# Altium schematic sheet rf_detector_pwr.SchDoc: SPE Router
size 420 x 297 mm; Author: P. Daniel; CompanyName: WUT ISE; DrawnBy: P. Daniel; Organization: WUT ISE; Address1: WUT ISE; Address2: Nowowiejska 15/19 00-665 Warsaw; Address3: piotrmaciejdaniel@gmail.com; Revision: 1; SheetNumber: 2; SheetTotal: 6; ModifiedBy: -; CreateDate: 02-03.2023; CheckedDate: -; Title2: PoE power supply; DivGrp: WUT ISE; Designer: Piotr Daniel
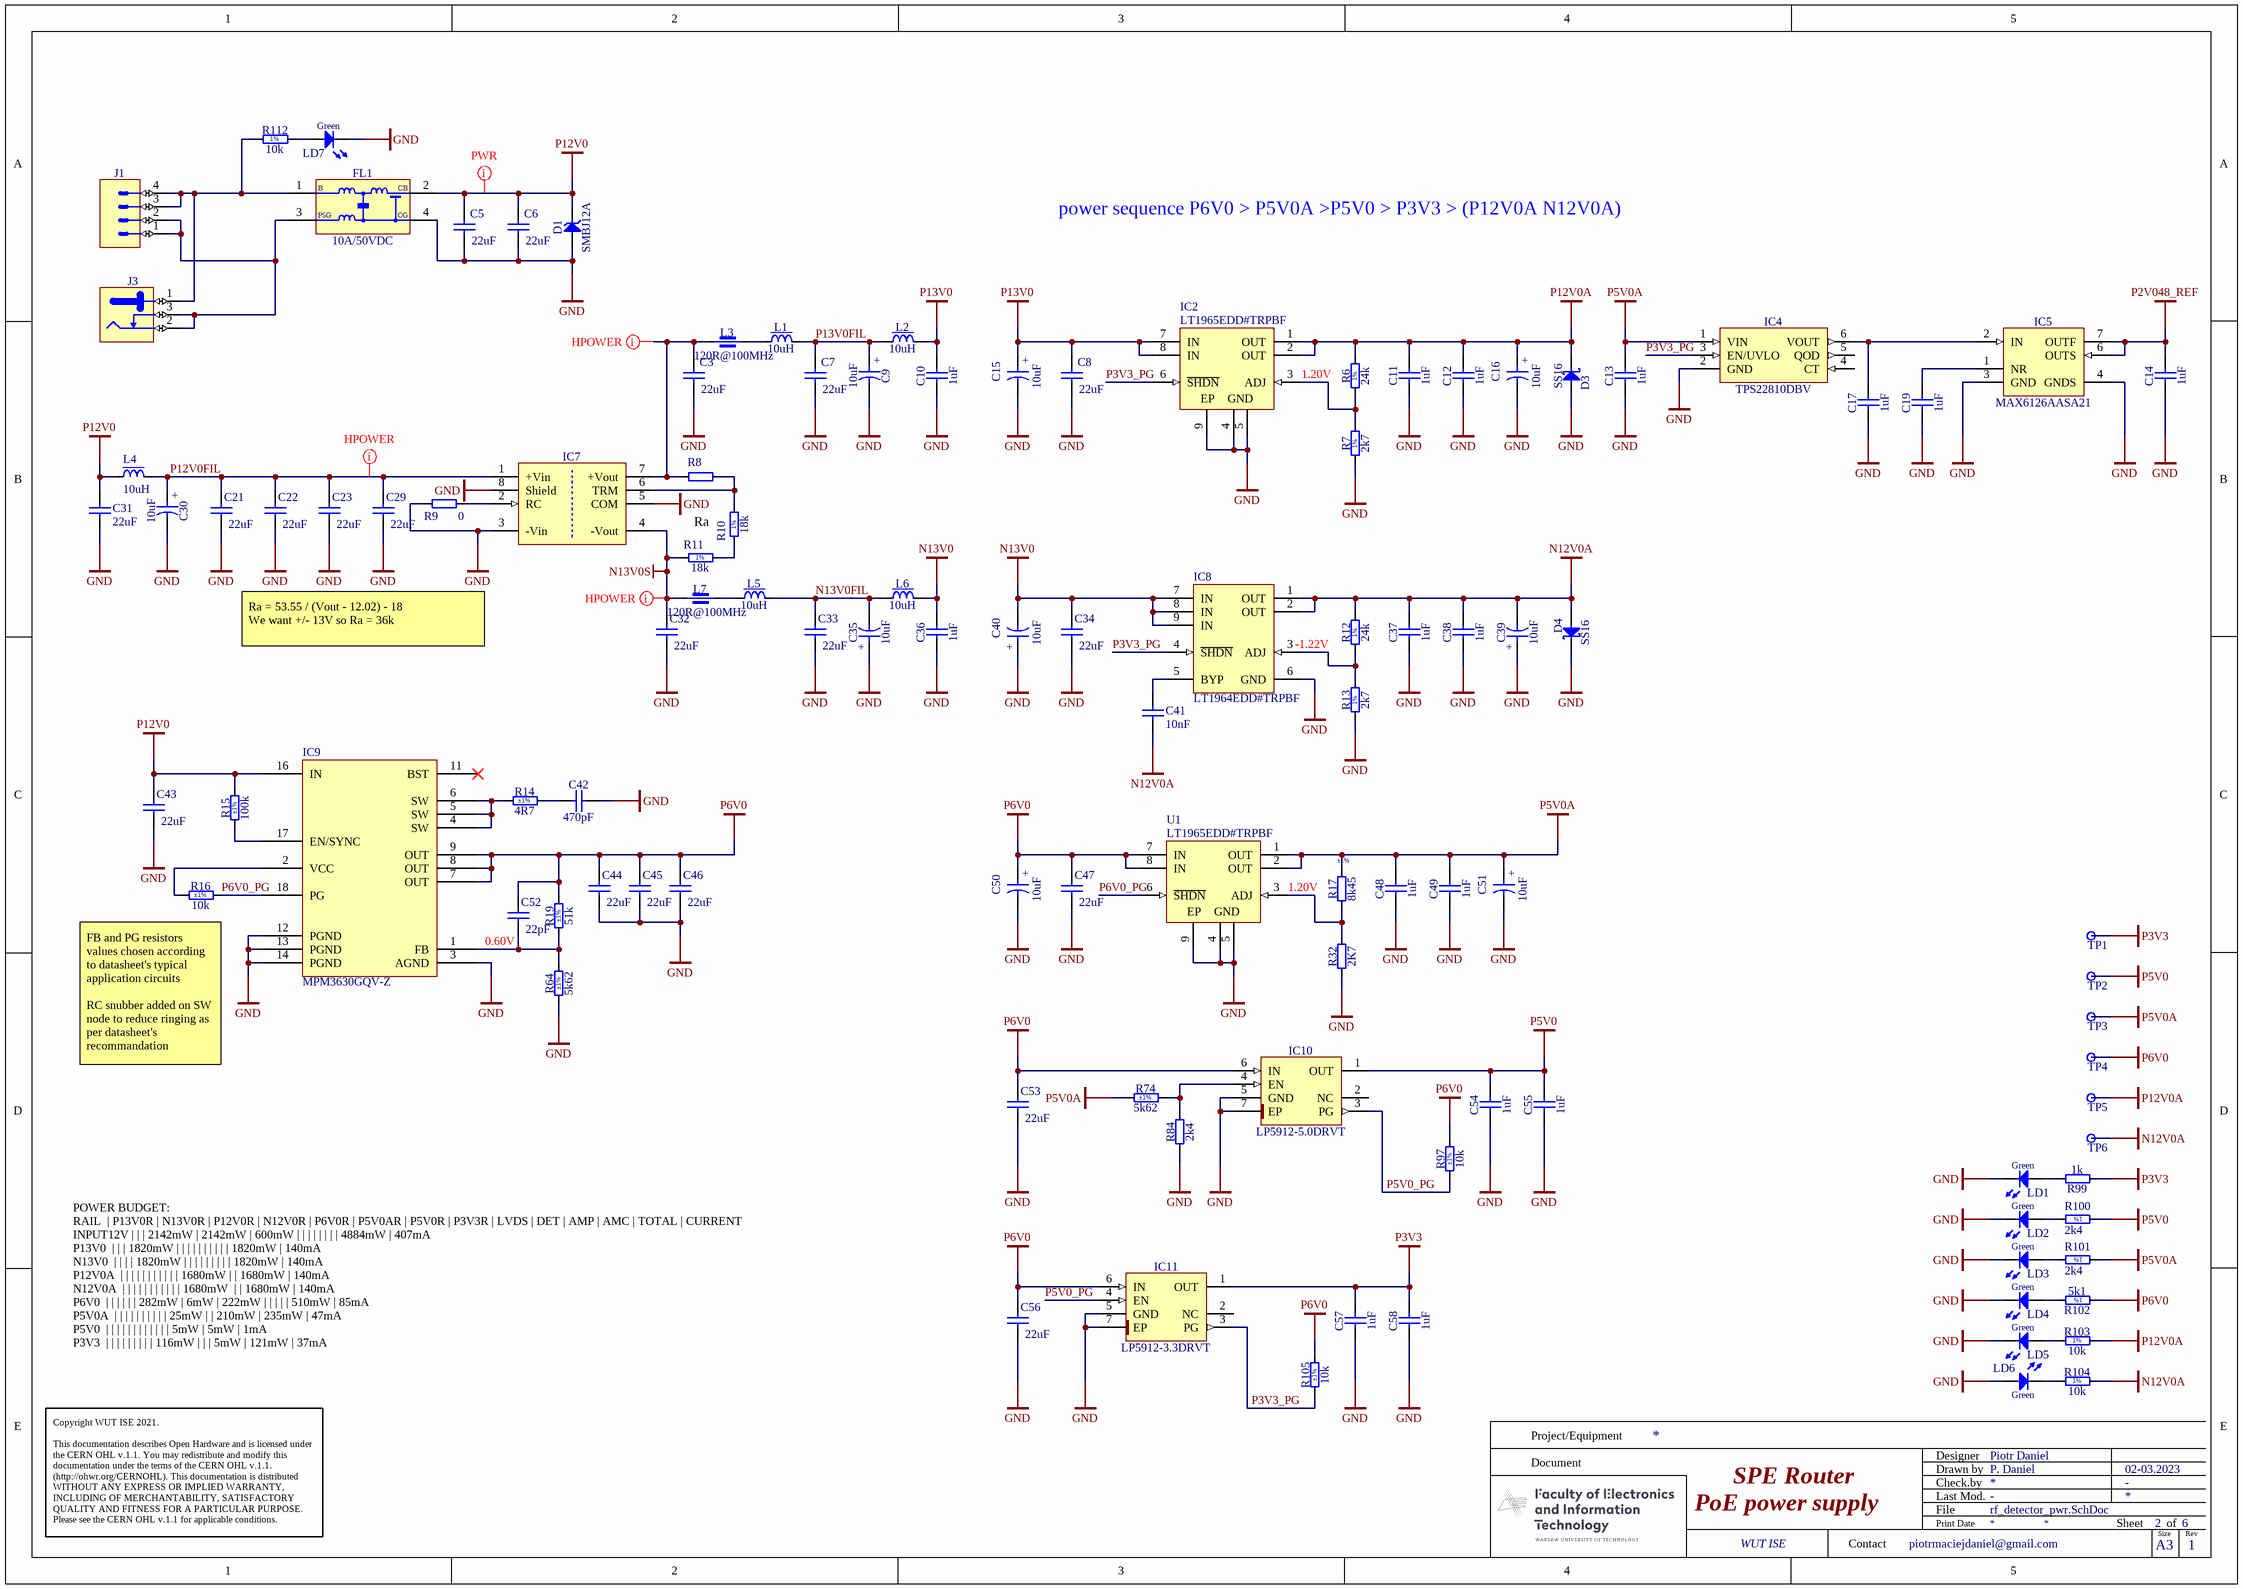
[diagram p0: rf_detector_pwr.SchDoc]

## Parts
C3  22uF  [CAPC3225X140N]
C5  22uF  [CAPC3225X140N]
C6  22uF  [CAPC3225X140N]
C7  22uF  [CAPC3225X140N]
C8  22uF  [CAPC3225X140N]
C9  10uF  [CAPMP3216X180N]
C10  1uF  [CAPC1608X87N]
C11  1uF  [CAPC1608X87N]
C12  1uF  [CAPC1608X87N]
C13  1uF  [CAPC1608X87N]
C14  1uF  [CAPC1608X87N]
C15  10uF  [CAPMP3216X180N]
C16  10uF  [CAPMP3216X180N]
C17  1uF  [CAPC1608X87N]
C19  1uF  [CAPC1608X87N]
C21  22uF  [CAPC3225X140N]
C22  22uF  [CAPC3225X140N]
C23  22uF  [CAPC3225X140N]
C29  22uF  [CAPC3225X140N]
C30  10uF  [CAPMP3216X180N]
C31  22uF  [CAPC2012X135N]
C32  22uF  [CAPC3225X140N]
C33  22uF  [CAPC3225X140N]
C34  22uF  [CAPC3225X140N]
C35  10uF  [CAPMP3216X180N]
C36  1uF  [CAPC1608X87N]
C37  1uF  [CAPC1608X87N]
C38  1uF  [CAPC1608X87N]
C39  10uF  [CAPMP3216X180N]
C40  10uF  [CAPMP3216X180N]
C41  10nF  [CAPC1608X87N]
C42  470pF  [CAPC1005X55N]
C43  22uF  [CAPC3225X140N]
C44  22uF  [CAPC3225X140N]
C45  22uF  [CAPC3225X140N]
C46  22uF  [CAPC3225X140N]
C47  22uF  [CAPC3225X140N]
C48  1uF  [CAPC1608X87N]
C49  1uF  [CAPC1608X87N]
C50  10uF  [CAPMP3216X180N]
C51  10uF  [CAPMP3216X180N]
C52  22pF  [CAPC1005X55N]
C53  22uF  [CAPC3225X140N]
C54  1uF  [CAPC1608X87N]
C55  1uF  [CAPC1608X87N]
C56  22uF  [CAPC3225X140N]
C57  1uF  [CAPC1608X87N]
C58  1uF  [CAPC1608X87N]
D1  SMBJ12A  [DIOM5336X265N]
D3  SS16  [DIOM5127X229N]
D4  SS16  [DIOM5127X229N]
FL1  10A/50VDC  [FIL_MURATA_BNX02]
IC2  LT1965EDD#TRPBF  [LT-DD-8_V]
IC4  TPS22810DBV  [SOT95P280X145-6N]
IC5  MAX6126AASA21  [SOIC127P600X175-8N]
IC7  (no value)  [CC6-1212DF-E]
IC8  LT1964EDD#TRPBF  [LT-DD-8_V]
IC9  MPM3630GQV-Z  [MPM3610A]
IC10  LP5912-5.0DRVT  [SON65P200X200X80-7N-R110X170]
IC11  LP5912-3.3DRVT  [SON65P200X200X80-7N-R110X170]
J1  Mini-Fit Jr.™  [MOLEX_39-30-0040]  (value not drawn)
J3  Jack  [SWITCHCRAFT_712RA]  (value not drawn)
L1  10uH  [IND_MURATA-PS_8400]
L2  10uH  [IND_MURATA-PS_8400]
L3  120R@100MHz  [INDC1608X95N]
L4  10uH  [IND_MURATA-PS_8400]
L5  10uH  [IND_MURATA-PS_8400]
L6  10uH  [IND_MURATA-PS_8400]
L7  120R@100MHz  [INDC1608X95N]
LD1  Green  [LED_KINGBRIGHT_KPH-1608CGCK]
LD2  Green  [LED_KINGBRIGHT_KPH-1608CGCK]
LD3  Green  [LED_KINGBRIGHT_KPH-1608CGCK]
LD4  Green  [LED_KINGBRIGHT_KPH-1608CGCK]
LD5  Green  [LED_KINGBRIGHT_KPH-1608CGCK]
LD6  Green  [LED_KINGBRIGHT_KPH-1608CGCK]
LD7  Green  [LED_KINGBRIGHT_KPH-1608CGCK]
R6  24k  [RESC1608X55N]
R7  2k7  [RESC1608X55N]
R8  Undefined  [RESC1608X55N]  (value not drawn)
R9  0  [RESC1005X40N]
R10  18k  [RESC1005X40N]
R11  18k  [RESC1005X40N]
R12  24k  [RESC1608X55N]
R13  2k7  [RESC1608X55N]
R14  4R7  Tolerance: ±1%  [RESC1005X40N]
R15  100k  Tolerance: ±1%  [RESC1005X40N]
R16  10k  Tolerance: ±1%  [RESC1005X40N]
R17  8k45  Tolerance: ±1%  [RESC1005X40N]
R19  51k  Tolerance: ±1%  [RESC1005X40N]
R32  2K7  [RESC1005X40N]
R64  5k62  Tolerance: ±1%  [RESC1005X40N]
R74  5k62  Tolerance: ±1%  [RESC1005X40N]
R84  2k4  [RESC1005X40N]
R97  10k  Tolerance: ±1%  [RESC1005X40N]
R99  1k  [RESC1005X40N]
R100  2k4  [RESC1005X40N]
R101  2k4  [RESC1005X40N]
R102  5k1  [RESC1005X40N]
R103  10k  [RESC1005X40N]
R104  10k  [RESC1005X40N]
R105  10k  Tolerance: ±1%  [RESC1005X40N]
R112  10k  [RESC1005X40N]
TP1  Test Point  [TPS127]  (value not drawn)
TP2  Test Point  [TPS127]  (value not drawn)
TP3  Test Point  [TPS127]  (value not drawn)
TP4  Test Point  [TPS127]  (value not drawn)
TP5  Test Point  [TPS127]  (value not drawn)
TP6  Test Point  [TPS127]  (value not drawn)
U1  LT1965EDD#TRPBF  [LT-DD-8_V]

## Nets
GND: C3.1 C5.1 C6.1 C7.1 C8.1 C9.2 C10.1 C11.1 C12.1 C13.1 C14.1 C15.2 C16.2 C17.1 C19.1 C21.1 C22.1 C23.1 C29.1 C30.2 C31.1 C32.1 C33.1 C34.1 C35.1 C36.1 C37.1 C38.1 C39.1 C40.1 C42.2 C43.1 C44.1 C45.1 C46.1 C47.1 C48.1 C49.1 C50.2 C51.2 C53.1 C54.1 C55.1 C56.1 C57.1 C58.1 D1.2(A) D3.2(A) D4.1(C) FL1.4(CG) IC2.4(GND) IC2.5(GND) IC2.9(EP) IC4.2(GND) IC5.3(GND) IC5.4(GNDS) IC7.3(-Vin) IC7.5(COM) IC7.8(Shield) IC8.6(GND) IC9.3(AGND) IC9.12(PGND) IC9.13(PGND) IC9.14(PGND) IC10.5(GND) IC10.7(EP) IC11.5(GND) IC11.7(EP) LD1.1(C) LD2.1(C) LD3.1(C) LD4.1(C) LD5.1(C) LD6.2(A) LD7.1(C) R7.1 R9.2 R13.1 R32.1 R64.1 R84.1 U1.4(GND) U1.5(GND) U1.9(EP)
N12V0A: C37.2 C38.2 C39.2 C41.1 D4.2(A) IC8.1(OUT) IC8.2(OUT) R12.2 R104.2 TP6.1
N13V0: C34.2 C36.2 C40.2 IC8.7(IN) IC8.8(IN) IC8.9(IN) L6.2
N13V0S: C32.2 IC7.4(-Vout) L7.1 R11.1
P2V048_REF: C14.2 IC5.6(OUTS) IC5.7(OUTF)
P3V3: C57.2 C58.2 IC11.1(OUT) R99.1 TP1.1
P5V0: C54.2 C55.2 IC10.1(OUT) R100.1 TP2.1
P5V0A: C13.2 C48.2 C49.2 C51.1 IC4.1(VIN) R17.2 R74.1 R101.1 TP3.1 U1.1(OUT) U1.2(OUT)
P6V0: C44.2 C45.2 C46.2 C47.2 C50.1 C52.2 C53.2 C56.2 IC9.7(OUT) IC9.8(OUT) IC9.9(OUT) IC10.6(IN) IC11.6(IN) R19.2 R97.2 R102.1 R105.2 TP4.1 U1.7(IN) U1.8(IN)
P12V0: C5.2 C6.2 C31.2 C43.2 D1.1(C) FL1.2(CB) IC9.16(IN) L4.1 R15.2
P12V0A: C11.2 C12.2 C16.1 D3.1(C) IC2.1(OUT) IC2.2(OUT) R6.2 R103.2 TP5.1
P13V0: C8.2 C10.2 C15.1 IC2.7(IN) IC2.8(IN) L2.2
N13V0FIL: C33.2 C35.2 L5.2 L6.1
P3V3_PG: IC2.6(~{SHDN}) IC4.3(EN/UVLO) IC8.4(~{SHDN}) IC11.3(PG) R105.1
P5V0_PG: IC10.3(PG) IC11.4(EN) R97.1
P6V0_PG: IC9.18(PG) R16.2 U1.6(~{SHDN})
P12V0FIL: C21.2 C22.2 C23.2 C29.2 C30.1 IC7.1(+Vin) L4.2
P13V0FIL: C7.2 C9.1 L1.2 L2.1
NetC3_2: C3.2 IC7.7(+Vout) L3.1 R8.1
NetC17_2: C17.2 IC4.6(VOUT) IC5.2(IN)
NetC19_2: C19.2 IC5.1(NR)
NetC41_2: C41.2 IC8.5(BYP)
NetC42_1: C42.1 R14.2
NetC52_1: C52.1 IC9.1(FB) R19.1 R64.2
NetFL1_1: FL1.1(B) J1.3 J1.4 J3.1 R112.1
NetFL1_3: FL1.3(PSG) J1.1 J1.2 J3.2 J3.3
NetIC2_3: IC2.3(ADJ) R6.1 R7.2
NetIC7_2: IC7.2(RC) R9.1
NetIC7_6: IC7.6(TRM) R8.2 R10.2
NetIC8_3: IC8.3(ADJ) R12.1 R13.2
NetIC9_2: IC9.2(VCC) R16.1
NetIC9_4: IC9.4(SW) IC9.5(SW) IC9.6(SW) R14.1
NetIC9_17: IC9.17(EN/SYNC) R15.1
NetIC10_4: IC10.4(EN) R74.2 R84.2
NetL1_1: L1.1 L3.2
NetL5_1: L5.1 L7.2
NetLD1_2: LD1.2(A) R99.2
NetLD2_2: LD2.2(A) R100.2
NetLD3_2: LD3.2(A) R101.2
NetLD4_2: LD4.2(A) R102.2
NetLD5_2: LD5.2(A) R103.1
NetLD6_1: LD6.1(C) R104.1
NetLD7_2: LD7.2(A) R112.2
NetR10_1: R10.1 R11.2
NetR17_1: R17.1 R32.2 U1.3(ADJ)

Not connected (* = marked no-connect by the designer): IC4 4(CT) 5(QOD); IC9 11(BST)*; IC10 2(NC); IC11 2(NC)

## Layout directives
net class PWR: P12V0
net class Hpower; rule Routing Via Style [Pref Size = 0.7mm    Pref Hole Size = 0.5mm]; rule Width Constraint [Pref Width = 20mil    Min Width = 15mil    Max Width = 50mil]: N13V0S, NetC3_2, P12V0FIL

## Notes on the sheet
- power sequence P6V0 > P5V0A >P5V0 > P3V3 > (P12V0A N12V0A)
- 1.20V
- Ra
- Ra = 53.55 / (Vout - 12.02) - 18
  We want +/- 13V so Ra = 36k
- -1.22V
- (near C52) 0.60V
- (near R16) FB and PG resistors values chosen according to datasheet's typical application circuits
  RC snubber added on SW node to reduce ringing as per datasheet's recommandation
- (near C56) POWER BUDGET:
  RAIL		| P13V0R	| N13V0R	| P12V0R	| N12V0R	| P6V0R	| P5V0AR	| P5V0R	| P3V3R	| LVDS	| DET	| AMP	| AMC	| TOTAL	| CURRENT
  INPUT12V	|	|	| 2142mW	| 2142mW	| 600mW	|	|	|	|	|	|	|	| 4884mW	| 407mA
  P13V0		|	|	| 1820mW	|	|	|	|	|	|	|	|	|	| 1820mW	| 140mA
  N13V0		|	|	|	| 1820mW	|	|	|	|	|	|	|	|	| 1820mW	| 140mA
  P12V0A		|	|	|	|	|	|	|	|	|	|	| 1680mW	|	| 1680mW	| 140mA
  N12V0A		|	|	|	|	|	|	|	|	|	|	| 1680mW 	|	| 1680mW	| 140mA
  P6V0		|	|	|	|	|	| 282mW	| 6mW	| 222mW	|	|	|	|	| 510mW	| 85mA
  P5V0A		|	|	|	|	|	|	|	|	|	| 25mW	|	| 210mW	| 235mW	| 47mA
  P5V0		|	|	|	|	|	|	|	|	|	|	|	| 5mW	| 5mW	| 1mA
  P3V3		|	|	|	|	|	|	|	|	| 116mW	|	|	| 5mW	| 121mW	| 37mA
- Project/Equipment
- Document
- Designer
- Drawn by
- Check.by
- Copyright WUT ISE 2021.
  This documentation describes Open Hardware and is licensed under the CERN OHL v.1.1. You may redistribute and modify this documentation under the terms of the CERN OHL v.1.1. (http://ohwr.org/CERNOHL). This documentation is distributed WITHOUT ANY EXPRESS OR IMPLIED WARRANTY, INCLUDING OF MERCHANTABILITY, SATISFACTORY QUALITY AND FITNESS FOR A PARTICULAR PURPOSE. Please see the CERN OHL v.1.1 for applicable conditions.
- Contact
- File
- Last Mod.
- Print Date
- Sheet
- Size
- A3
- of
- Rev
- (in symbol CTE3216-18_10UF_16V_20%_AVX_TCJ) +
- (in symbol R0402_2K4_1%_0.0625W_100PPM) 1%
- (in symbol R0402_5K1_1%_0.0625W_100PPM) 1%
- (in symbol R0402_10K_1%_0.0625W_100PPM) 1%
- (in symbol R0402_18K_1%_0.0625W_100PPM) 1%
- (in symbol R0603_2K7_1%_0.1W_100PPM) 1%
- (in symbol R0603_24K_1%_0.1W_100PPM) 1%

## Library data of the parts
C3 C5-C8 C21-C23 C29 C32-C34 C43-C47 C53 C56 = CC1210_22UF_25V_10%_X7R: Non-polarised capacitor; Part Description: SMD Multilayer Chip Ceramic Capacitor; Manufacturer: GENERIC; Manufacturer1 Part Number: C1210C226K3RAC; Voltage: 25V; TC: X7R; Tolerance: ±10%; Part Number: CC1210_22UF_25V_10%_X7R; Component Kind: Standard; Component Type: Standard; Pin Count: 2; Value: 22uF; Status: None; Manufacturer Part Number: CC1210_22UF_25V_10%_X7R; Case: 1210; Mounted: Yes; Socket: No; SMD: Yes; Sense: No; Manufacturer1 Example: KEMET; Manufacturer1 ComponentHeight: 1.4mm; HelpURL: \\cern.ch\dfs\Applications\Altium\Datasheets\CC1210_X7R_KEMET.pdf; Author: CERN DEM BC; CreateDate: 20.08.2020; LatestRevisionDate: 20.08.2020
C9 C15 C16 C30 C35 C39 C40 C50 C51 = CTE3216-18_10UF_16V_20%_AVX_TCJ: Polarised capacitor; Part Description: ESR 0R200 Tantalum Solid Electrolytic Chip Capacitor with Conductive Polymer Electrode; Manufacturer: AVX; Manufacturer Part Number: TCJA106M016R0200; Voltage: 16V; Tolerance: ±20%; Part Number: CTE3216-18_10UF_16V_20%_AVX_TCJ; Component Kind: Standard; Component Type: Standard; Pin Count: 2; Value: 10uF; Status: Preferred; Case: A; Mounted: Yes; Socket: No; SMD: Yes; Sense: No; ComponentHeight: 1.8mm; HelpURL: \\cern.ch\dfs\Applications\Altium\Datasheets\CTE_AVX_TCJ.pdf; Author: CERN DEM JLC; CreateDate: 29.03.2012; LatestRevisionDate: 29.03.2012
C10-C14 C17 C19 C36-C38 C48 C49 C54 C55 C57 C58 = CC0603_1UF_25V_10%_X7R: Non-polarised capacitor; Part Description: SMD Multilayer Chip Ceramic Capacitor; Manufacturer: GENERIC; Manufacturer1 Part Number: GRM188R71E105KA12D; Voltage: 25V; TC: X7R; Tolerance: ±10%; Part Number: CC0603_1UF_25V_10%_X7R; Component Kind: Standard; Component Type: Standard; Pin Count: 2; Value: 1uF; Status: None; Manufacturer Part Number: CC0603_1UF_25V_10%_X7R; Case: 0603; Mounted: Yes; Socket: No; SMD: Yes; Sense: No; Manufacturer1 Example: MURATA; Manufacturer1 ComponentHeight: 0.9mm; HelpURL: \\cern.ch\dfs\Applications\Altium\Datasheets\CC0603_X7R_MURATA.pdf; Author: CERN DEM JLC; CreateDate: 18.01.2011; LatestRevisionDate: 18.01.2011
C31 = CC0805_22UF_16V_10%_X5R: Non-polarised capacitor; Part Description: SMD Multilayer Chip Ceramic Capacitor; Manufacturer: GENERIC; Manufacturer1 Part Number: C2012X5R1C226KT; Voltage: 16V; TC: X5R; Tolerance: ±10%; Part Number: CC0805_22UF_16V_10%_X5R; Component Kind: Standard; Component Type: Standard; Pin Count: 2; Value: 22uF; Status: Preferred; Manufacturer Part Number: CC0805_22UF_16V_10%_X5R; Case: 0805; Mounted: Yes; Socket: No; SMD: Yes; Sense: No; Manufacturer1 Example: TDK; Manufacturer1 ComponentHeight: 1.35mm; HelpURL: \\cern.ch\dfs\Applications\Altium\Datasheets\CC0805_X5R_TDK_C.pdf; Author: CERN DEM JLC; CreateDate: 25.10.2012; LatestRevisionDate: 25.10.2012
C41 = CC0603_10NF_50V_10%_X7R: Non-polarised capacitor; Part Description: SMD Multilayer Chip Ceramic Capacitor; Manufacturer: GENERIC; Manufacturer1 Part Number: 223858615636; Voltage: 50V; TC: X7R; Tolerance: ±10%; Part Number: CC0603_10NF_50V_10%_X7R; Component Kind: Standard; Component Type: Standard; Pin Count: 2; Value: 10nF; Status: Preferred; Manufacturer Part Number: CC0603_10NF_50V_10%_X7R; Case: 0603; Mounted: Yes; Socket: No; SMD: Yes; Sense: No; Manufacturer1 Example: PHYCOMP; Manufacturer1 ComponentHeight: 0.87mm; HelpURL: \\cern.ch\dfs\Applications\Altium\Datasheets\CC0603_X7R_PHYCOMP.pdf; Author: CERN DEM JLC; CreateDate: 03.12.2007; LatestRevisionDate: 03.12.2007
C42 = CC0402_470PF_50V_10%_X7R: Non-polarised capacitor; Part Description: SMD Multilayer Chip Ceramic Capacitor; Manufacturer: GENERIC; Manufacturer1 Part Number: 223858715618; Voltage: 50V; TC: X7R; Tolerance: ±10%; Part Number: CC0402_470PF_50V_10%_X7R; Component Kind: Standard; Component Type: Standard; Pin Count: 2; Value: 470pF; Status: Not Recommended; Manufacturer Part Number: CC0402_470PF_50V_10%_X7R; Case: 0402; Mounted: Yes; Socket: No; SMD: Yes; Sense: No; Manufacturer1 Example: PHYCOMP; Manufacturer1 ComponentHeight: 0.55mm; HelpURL: \\cern.ch\dfs\Applications\Altium\Datasheets\CC0402_NP0_PHYCOMP.pdf; Author: CERN DEM JLC; CreateDate: 03.12.2007; LatestRevisionDate: 03.12.2007
C52 = CC0402_22PF_50V_5%_C0G: Non-polarised capacitor; Part Description: SMD Multilayer Chip Ceramic Capacitor; Manufacturer: GENERIC; Manufacturer1 Part Number: C0402C220J5GACTU; Voltage: 50V; TC: C0G/NP0; Tolerance: ±5%; Part Number: CC0402_22PF_50V_5%_C0G; Component Kind: Standard; Component Type: Standard; Pin Count: 2; Value: 22pF; Status: Preferred; Manufacturer Part Number: CC0402_22PF_50V_5%_C0G; Case: 0402; Mounted: Yes; Socket: No; SMD: Yes; Sense: No; Manufacturer1 Example: KEMET; Manufacturer1 ComponentHeight: 0.55mm; HelpURL: \\cern.ch\dfs\Applications\Altium\Datasheets\CC0402_C0G_KEMET_(Commercial Grade).pdf; Author: CERN DEM JLC; CreateDate: 03.12.2007; LatestRevisionDate: 03.12.2007
D1 = SMBJ12A: Zener Diode; Part Description: Uni-Directional Transient Voltage Suppressor Diode; Manufacturer: FAIRCHILD SEMICONDUCTOR; Voltage: 12V; Power: 600W; PressFit: No; Bonding: No; Part Number: SMBJ12A; Component Kind: Standard; Component Type: Standard; Device: SMBJ12A; PackageDescription: DO-214-AA/SMB Diode, Molded Body; 5.34mm L X 3.625mm W X 2.65mm H, IPC Medium Density; Manufacturer Part Number: SMBJ12A; Pin Count: 2; Case: DO-214AA; Mounted: Yes; Socket: No; SMD: Yes; Sense: No; ComponentHeight: 2.65mm; HelpURL: \\cern.ch\dfs\Applications\Altium\Datasheets\SMBJ.pdf; Author: CERN DEM JLC; CreateDate: 10.04.2013; LatestRevisionDate: 10.04.2013
D3 D4 = SS16: Schottky Diode; Part Description: Surface Mount Schottky Barrier Rectifier; Manufacturer: VISHAY GENERAL SEMICONDUCTOR; Voltage: 60V; Power: 1A; PressFit: No; Bonding: No; Part Number: SS16; Component Kind: Standard; Component Type: Standard; Device: SS16; PackageDescription: DO-214-AC Molded Diode, Body 5.1x2.7mm, IPC Medium Density; Manufacturer Part Number: SS16; Pin Count: 2; Case: DO-214AC; Mounted: Yes; Socket: No; SMD: Yes; Sense: No; ComponentHeight: 2.29mm; HelpURL: \\cern.ch\dfs\Applications\Altium\Datasheets\SS16.pdf; Author: CERN DEM JLC; CreateDate: 15.07.2008; LatestRevisionDate: 23.08.2010
FL1 = FIL_MURATA_BNX022-01L: Block Type EMIFIL (LC Combined); Part Description: Block Type EMIFIL (LC Combined) SMD Type, BNX02* Series; Manufacturer: MURATA; Resistance: 0.5R; Part Number: FIL_MURATA_BNX022-01L; Component Kind: Standard; Component Type: Standard; Pin Count: 2; Value: 10A/50VDC; Status: None; Manufacturer Part Number: BNX022-01L; Mounted: Yes; Socket: No; SMD: Yes; Sense: No; ComponentHeight: 3.3mm; HelpURL: \\cern.ch\dfs\Applications\Altium\Datasheets\FIL_MURATA_BNX022-01L.pdf; Author: CERN DEM JLC; CreateDate: 10.10.2012; LatestRevisionDate: 10.10.2012
IC2 U1 = CMP-0476-00217-1: 1.1 A, Low Noise, Low Dropout Linear Regulator, 1.8 to 20 V Vin, Adjustable Vout, 8-pin SON (DD-8), -40 to 125 degC, Pb-Free, Tape and Reel; Manufacturer: Linear Technology; Vin Max(V): 20; Vin Min(V): 1.8; Shutdown Current(uA): 1; Output Voltage: Adj; Discrete Pass Element: no; Vout Min(V): 1.2; PSRR(dB): 75; Isupply(mA): 0.5; Dropout Voltage(V): 0.31; Iout(mA): 1100; Noise(uV): 40; Vout Max(V): 19.5; PackageDescription: 8-Pin Plastic DFN, Body 3 x 3 mm, Pitch 0.5 mm; PackageReference: DD-8; RoHS: TRUE; DatasheetVersion: Rev. A; ComponentLink1Description: Manufacturer URL; Mounting Technology: Surface Mount; Code_JEDEC: MO-229; ComponentLink1URL: http://www.linear.com/; ComponentLink2Description: Datasheet; PartNumber: LT1965EDD#TRPBF; Packing: Tape and Reel; ComponentLink2URL: http://cds.linear.com/docs/en/datasheet/1965fa.pdf; Number of Outputs: 1; PackageVersion: Jun-10; ComponentLink3Description: Package Specification; ComponentLink3URL: http://cds.linear.com/docs/en/packaging/DFN_8_05-08-1698.pdf
IC4 = TPS22810DBV: 2.7-18V, 2A, 79mOhm On-Resistance Load Switch With Thermal Protection; Manufacturer: TEXAS INSTRUMENTS; PressFit: No; Bonding: No; Part Number: TPS22810DBV; Component Kind: Standard; Component Type: Standard; Device: TPS22810DBV; PackageDescription: SOT, 0.95mm Pitch; 6 Pin, 1.60mm W X 2.90mm L X 1.45mm H body, IPC Medium Density; Part Description: 2.7-18V, 2A, 79mOhm On-Resistance Load Switch with Thermal Protection; Manufacturer Part Number: TPS22810DBV; Pin Count: 6; Case: SOT23-6; Mounted: Yes; Socket: No; SMD: Yes; Sense: No; ComponentHeight: 1.45mm; Author: CERN DEM MR; HelpURL: \\cern.ch\dfs\Applications\Altium\Datasheets\TPS22810DBV.pdf; CreateDate: 11.07.2019; LatestRevisionDate: 11.07.2019
IC5 = MAX6126BASA21: Ultra-High-Precision, Ultra-Low-Noise, Voltage Reference; Part Description: 2.048V, 0.02%, 3ppm/°C, Ultra-High-Precision, Ultra-Low-Noise, Voltage References; Manufacturer: MAXIM; PressFit: No; Bonding: No; Part Number: MAX6126AASA21; Component Kind: Standard; Component Type: Standard; Device: MAX6126AASA21; PackageDescription: SOIC 8, Pitch 1.27mm, Body 4x5mm, IPC Medium Density; Manufacturer Part Number: MAX6126AASA21; Pin Count: 8; Case: SOIC8; Mounted: Yes; Socket: No; SMD: Yes; Sense: No; ComponentHeight: 1.75mm; HelpURL: \\cern.ch\dfs\Applications\Altium\Datasheets\MAX6126.pdf; Author: CERN DEM HF; CreateDate: 09.05.2022; LatestRevisionDate: 09.05.2022
IC7 = DC/DC_CC6-1212DF-E: CONV DC/DC 6W DUAL 12V +-12V PCB; Manufacturer: TDK-Lambda Americas Inc.; PressFit: No; Bonding: No; Part Number: CC6-1212DF-E; Component Kind: Standard; Component Type: Standard; Device: CC6-1212DF-E; PackageDescription: CC6 Series, Body 0.900 x 0.831 x 0.335, Regulated; Part Description: CONV DC/DC 6W DUAL 12V +-12V PCB; Manufacturer Part Number: CC6-1212DF-E; Pin Count: 7; Mounted: Yes; Socket: No; SMD: No; Sense: No; ComponentHeight: 10.45mm; Author: GK; CreateDate: 17.12.2016; LatestRevisionDate: 17.12.2016
IC8 = CMP-0476-00218-1: 200 mA, Low Noise, Low Dropout Negative Micropower Regulator, -1.9 to -20 V Vin, Adjustable Vout, 8-pin SON (DD-8), -40 to 125 degC, Pb-Free, Tape and Reel; Manufacturer: Linear Technology; Noise(uV): 30; Discrete Pass Element: no; Shutdown Current(uA): 3; Number of Outputs: 1; Isupply(mA): 0.03; Output Voltage: Adj; Dropout Voltage(V): 0.34; PSRR(dB): 54; Iout(mA): 200; Vout Max(V): -1.22; ComponentLink1URL: http://www.linear.com/; DatasheetVersion: Rev. B; ComponentLink3Description: Package Specification; PackageVersion: Jun-10; Mounting Technology: Surface Mount; PartNumber: LT1964EDD#TRPBF; ComponentLink3URL: http://cds.linear.com/docs/en/packaging/DFN_8_05-08-1698.pdf; ComponentLink2Description: Datasheet; PackageDescription: 8-Pin Plastic DFN, Body 3 x 3 mm, Pitch 0.5 mm; Vout Min(V): -20; Vin Max(V): -1.9; RoHS: TRUE; PackageReference: DD-8; Packing: Tape and Reel; Code_JEDEC: MO-229; Vin Min(V): -20; ComponentLink2URL: http://cds.linear.com/docs/en/datasheet/1964fb.pdf; ComponentLink1Description: Manufacturer URL
IC9 = MPM3630GQV-Z: 18V/3A DC/DC Module Synchronous Step-Down Regulator with Integrated Inductor; Manufacturer: Monolithic Power Systems; Supplier 1: Farnell; Manufacturer Part Number: MPM3630GQV-Z; RoHS: Yes; Category: Board Mount Modules; Stock 1: 4233; Case/Package: QFN; Pins: 18; Series: *; RoHS Compliant: Yes; ComponentLink1URL: http://www.monolithicpower.com/pub/media/document/MPM3630_r1.0.pdf?src-supplier=Digikey; ComponentLink1Description: http://www.monolithicpower.com/pub/media/document/MPM3630_r1.0.pdf?src-supplier=Digikey; ComponentLink2URL: https://www.monolithicpower.com/pub/media/document/MPM3630_r1.0.pdf?src-supplier=Digikey; ComponentLink2Description: https://www.monolithicpower.com/pub/media/document/MPM3630_r1.0.pdf?src-supplier=Digikey; ComponentLink3URL: https://datasheet.octopart.com/MPM3630GQV-Z-Monolithic-Power-Systems-datasheet-140259359.pdf?src-supplier=Newark; ComponentLink3Description: https://datasheet.octopart.com/MPM3630GQV-Z-Monolithic-Power-Systems-datasheet-140259359.pdf?src-supplier=Newark; ComponentLink4URL: https://datasheet.octopart.com/MPM3630GQV-Z-Monolithic-Power-Systems-datasheet-81324618.pdf?src-supplier=Future+Electronics; ComponentLink4Description: https://datasheet.octopart.com/MPM3630GQV-Z-Monolithic-Power-Systems-datasheet-81324618.pdf?src-supplier=Future+Electronics; ComponentLink5URL: https://www.monolithicpower.com/DesktopModules/DocumentManage/API/Document/GetDocument?id=4863&src-supplier=Digikey; ComponentLink5Description: https://www.monolithicpower.com/DesktopModules/DocumentManage/API/Document/GetDocument?id=4863&src-supplier=Digikey; ComponentLink6URL: https://datasheet.octopart.com/MPM3630GQV-Z-Monolithic-Power-Systems-datasheet-155982336.pdf?src-supplier=Monolithic+Power+Systems; ComponentLink6Description: https://datasheet.octopart.com/MPM3630GQV-Z-Monolithic-Power-Systems-datasheet-155982336.pdf?src-supplier=Monolithic+Power+Systems; Supplier Part Number 1: 3358182
IC10 = LP5912-3.3DRVT: 5.0V, 500mA Low-Noise, Low-IQ LDO; Part Description: 5.0V, 500mA Low-Noise, Low-IQ, LDO Linear Regulator; Manufacturer: TEXAS INSTRUMENTS; PressFit: No; Bonding: No; Part Number: LP5912-5.0DRVT; Component Kind: Standard; Component Type: Standard; Device: LP5912-5.0DRVT; PackageDescription: SON, 0.65mm Pitch; 6 Pin, 2.00mm W X 2.00mm L X 0.80mm H body (w/Thermal Tab 1.10 X 1.70mm),  IPC Medium Density; Manufacturer Part Number: LP5912-5.0DRVT; Pin Count: 7; Case: SON6; Mounted: Yes; Socket: No; SMD: Yes; Sense: No; ComponentHeight: 0.8mm; HelpURL: \\cern.ch\dfs\Applications\Altium\Datasheets\LP5912-3.3DRVT.pdf; Author: CERN DEM JLC; CreateDate: 06.06.2017; LatestRevisionDate: 06.06.2017
IC11 = LP5912-3.3DRVT: 3.3V, 500mA Low-Noise, Low-IQ LDO; Part Description: 3.3V, 500mA Low-Noise, Low-IQ, LDO Linear Regulator; Manufacturer: TEXAS INSTRUMENTS; PressFit: No; Bonding: No; Part Number: LP5912-3.3DRVT; Component Kind: Standard; Component Type: Standard; Device: LP5912-3.3DRVT; PackageDescription: SON, 0.65mm Pitch; 6 Pin, 2.00mm W X 2.00mm L X 0.80mm H body (w/Thermal Tab 1.10 X 1.70mm),  IPC Medium Density; Manufacturer Part Number: LP5912-3.3DRVT; Pin Count: 7; Case: SON6; Mounted: Yes; Socket: No; SMD: Yes; Sense: No; ComponentHeight: 0.8mm; HelpURL: \\cern.ch\dfs\Applications\Altium\Datasheets\LP5912-3.3DRVT.pdf; Author: CERN DEM JLC; CreateDate: 06.06.2017; LatestRevisionDate: 06.06.2017
J1 = MOLEX_39-30-0040: Connector 4 Male; Part Description: 4.20mm (.165") Pitch Mini-Fit Jr. Header, Dual Row, Right Angle with Snap-in Plastic Peg PCB Lock, 4 Circuits; Manufacturer: MOLEX; PressFit: No; Part Number: MOLEX_39-30-0040; Component Kind: Standard; Component Type: Standard; Pin Count: 4; Family: Mini-Fit Jr.™; Mounted: Yes; Socket: No; SMD: No; Sense: No; Status: None; Manufacturer Part Number: 39-30-0040; ComponentHeight: 11.4mm; HelpURL: \\cern.ch\dfs\Applications\Altium\Datasheets\MOLEX_39-30-0040.pdf; Author: CERN DEM JLC; CreateDate: 2018-10-02; LatestRevisionDate: 2018-10-02
J3 = SWITCHCRAFT_712RA: 2.5 mm Center Pin, 5A, 48V, Right Angle, Through Hole, , DC Power Jack Connector; Part Description: 2.5 mm Center Pin, 5A, 48VDC, Right Angle, Through Hole, Locking Power Jack Connector (Threaded Bushings); Manufacturer Part Number: 712RA; PressFit: No; Part Number: SWITCHCRAFT_712RA; Component Kind: Standard; Component Type: Standard; Pin Count: 3; Family: Jack; Mounted: Yes; Socket: No; SMD: No; Sense: No; Status: None; Manufacturer: SWITCHCRAFT; ComponentHeight: 13.8mm; HelpURL: \\cern.ch\dfs\Applications\Altium\Datasheets\SWITCHCRAFT_712RA.pdf; Author: CERN DEM JLC; CreateDate: 2017-12-19; LatestRevisionDate: 2017-12-19
L1 L2 L4-L6 = IND_10UH_10%_MURATA-PS_8400: Inductor With Core; Part Description: Miniature Surface Mount Power Inductor (8400 Serie); Manufacturer: MURATA POWER SOLUTIONS; Manufacturer Part Number: 84103C; Power: 950mA; Resistance: 0.24R; Tolerance: ±10%; Part Number: IND_10UH_10%_MURATA-PS_8400; Component Kind: Standard; Component Type: Standard; Pin Count: 2; Value: 10uH; Status: None; Mounted: Yes; Socket: No; SMD: Yes; Sense: No; ComponentHeight: 2.9mm; HelpURL: \\cern.ch\dfs\Applications\Altium\Datasheets\IND_MURATA-PS_8400.pdf; Author: CERN DEM JLC; CreateDate: 02.07.2012; LatestRevisionDate: 02.07.2012
L3 L7 = IND0603_MURATA_BLM18PG121SN1D: Part Description: SMD EMIFIL Chip Ferrite Bead; Manufacturer: MURATA; Power: 2A; Resistance: 0.05R; Part Number: IND0603_MURATA_BLM18PG121SN1D; Component Kind: Standard; Component Type: Standard; Pin Count: 2; Value: 120R@100MHz; Manufacturer Part Number: BLM18PG121SN1D; Case: 0603; Mounted: Yes; Socket: No; SMD: Yes; Sense: No; ComponentHeight: 0.95mm; HelpURL: \\cern.ch\dfs\Applications\Altium\Datasheets\IND0603_MURATA_BLM18P.pdf; Author: CERN DEM BC; CreateDate: 27.07.2015; LatestRevisionDate: 25.10.2018
LD1-LD7 = LED_KINGBRIGHT_KPH-1608CGCK: LED Green 1C 2A; Part Description: SMD Green LED, Case 1.6mmX0.8mm(0603), 0.65mm Thickness; PressFit: No; Bonding: No; Part Number: LED_KINGBRIGHT_KPH-1608CGCK; Component Kind: Standard; Component Type: Standard; Color: Green; PackageDescription: SMT Green LED, Case 0603, Body L 1.6 x W 0.8mm H 0.65mm; Manufacturer: KINGBRIGHT; Manufacturer Part Number: KPH-1608CGCK; Pin Count: 2; Mounted: Yes; Socket: No; SMD: Yes; Sense: No; ComponentHeight: 0.65mm; HelpURL: \\cern.ch\dfs\Applications\Altium\Datasheets\LED_KINGBRIGHT_KPH-1608CGCK.pdf; Author: CERN DEM JLC; CreateDate: 03/07/2017; LatestRevisionDate: 03/07/2017
R6 R12 = R0603_24K_1%_0.1W_100PPM: Resistor - 1%; Part Description: General Purpose Thick Film Chip Resistor; Manufacturer: GENERIC; Manufacturer1 Part Number: NRC06F2402TRF; Power: 0.1W; TC: ±100ppm/°C; Part Number: R0603_24K_1%_0.1W_100PPM; Component Kind: Standard; Component Type: Standard; Pin Count: 2; Value: 24k; Status: Preferred; Tolerance: ±1%; Manufacturer Part Number: R0603_24K_1%_0.1W_100PPM; Case: 0603; Mounted: Yes; Sense: No; Socket: No; SMD: Yes; Manufacturer1 Example: NIC COMPONENT; Manufacturer1 ComponentHeight: 0.55mm; HelpURL: \\cern.ch\dfs\Applications\Altium\Datasheets\R0603_NIC_NRC.pdf; Author: CERN DEM JLC; CreateDate: 03.12.2007; LatestRevisionDate: 13.03.2008
R7 R13 = R0603_2K7_1%_0.1W_100PPM: Resistor - 1%; Part Description: General Purpose Thick Film Chip Resistor; Manufacturer: GENERIC; Manufacturer1 Part Number: RC0603FR-072K7L; Power: 0.1W; TC: ±100ppm/°C; Part Number: R0603_2K7_1%_0.1W_100PPM; Component Kind: Standard; Component Type: Standard; Pin Count: 2; Value: 2k7; Status: Preferred; Tolerance: ±1%; Manufacturer Part Number: R0603_2K7_1%_0.1W_100PPM; Case: 0603; Mounted: Yes; Sense: No; Socket: No; SMD: Yes; Manufacturer1 Example: YAGEO PHYCOMP; Manufacturer1 ComponentHeight: 0.55mm; HelpURL: \\cern.ch\dfs\Applications\Altium\Datasheets\R0603_PHYCOMP_RC0603.pdf; Author: CERN DEM JLC; CreateDate: 02.05.2011; LatestRevisionDate: 02.05.2011
R8 = R0603_NO-VALUE: Resistor; Part Description: Reserved Footprint For a 0603 (1608) Chip Resistor; Mounted: No; Part Number: R0603_NO-VALUE; Component Kind: Standard; Component Type: Standard; Pin Count: 2; Value: Undefined; Status: None; Manufacturer: Undefined; Manufacturer Part Number: R0603_NO-VALUE; Case: 0603; Sense: No; Socket: No; SMD: Yes; Manufacturer1 Example: Undefined; Manufacturer1 Part Number: Undefined; Manufacturer1 ComponentHeight: Undefined; HelpURL: Undefined; Author: CERN DEM JLC; CreateDate: 03.12.2007; LatestRevisionDate: 13.03.2008
R9 = R0402_0R_JUMPER: Resistor; Part Description: 1A (0.05R Max DC Resistance) Zero Ohm Jumper; Manufacturer: GENERIC; Manufacturer1 Part Number: 232270591001L; Part Number: R0402_0R_JUMPER; Component Kind: Standard; Component Type: Standard; Pin Count: 2; Value: 0; Status: Not recommended; Manufacturer Part Number: R0402_0R_JUMPER; Case: 0402; Mounted: Yes; Sense: No; Socket: No; SMD: Yes; Manufacturer1 Example: YAGEO PHYCOMP; Manufacturer1 ComponentHeight: 0.4mm; HelpURL: \\cern.ch\dfs\Applications\Altium\Datasheets\R0402_Phycomp_RC0402.pdf; Author: CERN DEM JLC; CreateDate: 03.12.2007; LatestRevisionDate: 17.10.2012
R10 R11 = R0402_18K_1%_0.0625W_100PPM: Resistor - 1%; Part Description: General Purpose Thick Film Chip Resistor; Manufacturer: GENERIC; Manufacturer1 Part Number: 232270671803L; TC: ±100ppm/°C; PressFit: No; Part Number: R0402_18K_1%_0.0625W_100PPM; Component Kind: Standard; Component Type: Standard; Pin Count: 2; Value: 18k; Status: Not Recommended; Power: 0.0625W; Tolerance: ±1%; Manufacturer Part Number: R0402_18K_1%_0.0625W_100PPM; Case: 0402; Mounted: Yes; Sense: No; Socket: No; SMD: Yes; Manufacturer1 Example: YAGEO PHYCOMP; Manufacturer1 ComponentHeight: 0.4mm; HelpURL: \\cern.ch\dfs\Applications\Altium\Datasheets\R0402_Phycomp_RC0402.pdf; Author: CERN DEM JLC; CreateDate: 03.12.2007; LatestRevisionDate: 17.10.2012
R14 = R0402_4R7_1%_0.0625W_200PPM: Resistor - 1%; Part Description: General Purpose Thick Film Chip Resistor; Manufacturer: GENERIC; Manufacturer1 Part Number: 232270674708L; TC: ±200ppm/°C; PressFit: No; Part Number: R0402_4R7_1%_0.0625W_200PPM; Component Kind: Standard; Component Type: Standard; Pin Count: 2; Value: 4R7; Status: Not Recommended; Power: 0.0625W; Manufacturer Part Number: R0402_4R7_1%_0.0625W_200PPM; Case: 0402; Mounted: Yes; Sense: No; Socket: No; SMD: Yes; Manufacturer1 Example: YAGEO PHYCOMP; Manufacturer1 ComponentHeight: 0.4mm; HelpURL: \\cern.ch\dfs\Applications\Altium\Datasheets\R0402_Phycomp_RC0402.pdf; Author: CERN DEM JLC; CreateDate: 03.12.2007; LatestRevisionDate: 17.10.2012
R15 = R0402_100K_1%_0.0625W_100PPM: Resistor - 1%; Part Description: General Purpose Thick Film Chip Resistor; Manufacturer: GENERIC; Manufacturer1 Part Number: 232270671004L; TC: ±100ppm/°C; PressFit: No; Part Number: R0402_100K_1%_0.0625W_100PPM; Component Kind: Standard; Component Type: Standard; Pin Count: 2; Value: 100k; Status: Not Recommended; Power: 0.0625W; Manufacturer Part Number: R0402_100K_1%_0.0625W_100PPM; Case: 0402; Mounted: Yes; Sense: No; Socket: No; SMD: Yes; Manufacturer1 Example: YAGEO PHYCOMP; Manufacturer1 ComponentHeight: 0.4mm; HelpURL: \\cern.ch\dfs\Applications\Altium\Datasheets\R0402_Phycomp_RC0402.pdf; Author: CERN DEM JLC; CreateDate: 03.12.2007; LatestRevisionDate: 17.10.2012
R16 R97 R103-R105 R112 = R0402_10K_1%_0.0625W_100PPM: Resistor - 1%; Part Description: General Purpose Thick Film Chip Resistor; Manufacturer: GENERIC; Manufacturer1 Part Number: 232270671003L; TC: ±100ppm/°C; PressFit: No; Part Number: R0402_10K_1%_0.0625W_100PPM; Component Kind: Standard; Component Type: Standard; Pin Count: 2; Value: 10k; Status: Not Recommended; Power: 0.0625W; Manufacturer Part Number: R0402_10K_1%_0.0625W_100PPM; Case: 0402; Mounted: Yes; Sense: No; Socket: No; SMD: Yes; Manufacturer1 Example: YAGEO PHYCOMP; Manufacturer1 ComponentHeight: 0.4mm; HelpURL: \\cern.ch\dfs\Applications\Altium\Datasheets\R0402_Phycomp_RC0402.pdf; Author: CERN DEM JLC; CreateDate: 03.12.2007; LatestRevisionDate: 17.10.2012
  R103 R104 R112: Tolerance: ±1%
R17 = R0402_8K2_1%_0.0625W_100PPM: Resistor - 1%; Part Number: R0402_8K45_1%_0.0625W_100PPM; Part Description: General Purpose Thick Film Chip Resistor; Manufacturer: GENERIC; TC: ±100ppm/°C; PressFit: No; Component Kind: Standard; Component Type: Standard; Pin Count: 2; Value: 8k45; Status: Not Recommended; Power: 0.0625W; Manufacturer Part Number: R0402_8K45_1%_0.0625W_100PPM; Case: 0402; Mounted: Yes; Sense: No; Socket: No; SMD: Yes; Manufacturer1 Example: YAGEO PHYCOMP; Manufacturer1 ComponentHeight: 0.4mm; HelpURL: \\cern.ch\dfs\Applications\Altium\Datasheets\R0402_Phycomp_RC0402.pdf; Author: CERN DEM JLC; CreateDate: 03.12.2007; LatestRevisionDate: 17.10.2012
R19 = R0402_51K_1%_0.0625W_100PPM: Resistor - 1%; Part Description: General Purpose Thick Film Chip Resistor; Manufacturer: GENERIC; Manufacturer1 Part Number: 232270675103L; TC: ±100ppm/°C; PressFit: No; Part Number: R0402_51K_1%_0.0625W_100PPM; Component Kind: Standard; Component Type: Standard; Pin Count: 2; Value: 51k; Status: Not Recommended; Power: 0.0625W; Manufacturer Part Number: R0402_51K_1%_0.0625W_100PPM; Case: 0402; Mounted: Yes; Sense: No; Socket: No; SMD: Yes; Manufacturer1 Example: YAGEO PHYCOMP; Manufacturer1 ComponentHeight: 0.4mm; HelpURL: \\cern.ch\dfs\Applications\Altium\Datasheets\R0402_Phycomp_RC0402.pdf; Author: CERN DEM JLC; CreateDate: 03.12.2007; LatestRevisionDate: 17.10.2012
R32 = R0402_2K49_1%_0.063W_100PPM: Resistor - 0.1%; Part Number: R0402_2K7_0.1%_0.063W_50PPM; Part Description: General Purpose Thick Film Chip Resistor; Manufacturer: GENERIC; Power: 0.063W; TC: ±50ppm/°C; PressFit: No; Component Kind: Standard; Component Type: Standard; Pin Count: 2; Value: 2K7; Status: None; Tolerance: ±0.1%; Manufacturer Part Number: R0402_2K7_0.1%_0.063W_50PPM; Case: 0402; Mounted: Yes; Sense: No; Socket: No; SMD: Yes; Manufacturer1 ComponentHeight: 0.4mm; HelpURL: \\cern.ch\dfs\Applications\Altium\Datasheets\R0402_VISHAY_CRCW e3.pdf; Author: CERN DEM BC; CreateDate: 10.01.2020; LatestRevisionDate: 10.01.2020
R64 R74 = R0402_5K6_1%_0.0625W_100PPM: Resistor - 1%; Part Number: R0402_5K62_1%_0.0625W_100PPM; Part Description: General Purpose Thick Film Chip Resistor; Manufacturer: GENERIC; TC: ±100ppm/°C; PressFit: No; Component Kind: Standard; Component Type: Standard; Pin Count: 2; Value: 5k62; Status: Not Recommended; Power: 0.0625W; Manufacturer Part Number: R0402_5K62_1%_0.0625W_100PPM; Case: 0402; Mounted: Yes; Sense: No; Socket: No; SMD: Yes; Manufacturer1 ComponentHeight: 0.4mm; HelpURL: \\cern.ch\dfs\Applications\Altium\Datasheets\R0402_Phycomp_RC0402.pdf; Author: CERN DEM JLC; CreateDate: 03.12.2007; LatestRevisionDate: 17.10.2012; Manufacturer1 Example: YAGEO PHYCOMP
R84 R100 R101 = R0402_2K4_1%_0.0625W_100PPM: Resistor - 1%; Part Description: General Purpose Thick Film Chip Resistor; Manufacturer: GENERIC; Manufacturer1 Part Number: 232270672402L; TC: ±100ppm/°C; PressFit: No; Part Number: R0402_2K4_1%_0.0625W_100PPM; Component Kind: Standard; Component Type: Standard; Pin Count: 2; Value: 2k4; Status: Not Recommended; Power: 0.0625W; Tolerance: ±1%; Manufacturer Part Number: R0402_2K4_1%_0.0625W_100PPM; Case: 0402; Mounted: Yes; Sense: No; Socket: No; SMD: Yes; Manufacturer1 Example: YAGEO PHYCOMP; Manufacturer1 ComponentHeight: 0.4mm; HelpURL: \\cern.ch\dfs\Applications\Altium\Datasheets\R0402_Phycomp_RC0402.pdf; Author: CERN DEM JLC; CreateDate: 03.12.2007; LatestRevisionDate: 17.10.2012
R99 = R0402_1K_1%_0.0625W_100PPM: Resistor - 1%; Part Description: General Purpose Thick Film Chip Resistor; Manufacturer: GENERIC; Manufacturer1 Part Number: 232270671002L; TC: ±100ppm/°C; PressFit: No; Part Number: R0402_1K_1%_0.0625W_100PPM; Component Kind: Standard; Component Type: Standard; Pin Count: 2; Value: 1k; Status: Not Recommended; Power: 0.0625W; Tolerance: ±1%; Manufacturer Part Number: R0402_1K_1%_0.0625W_100PPM; Case: 0402; Mounted: Yes; Sense: No; Socket: No; SMD: Yes; Manufacturer1 Example: YAGEO PHYCOMP; Manufacturer1 ComponentHeight: 0.4mm; HelpURL: \\cern.ch\dfs\Applications\Altium\Datasheets\R0402_Phycomp_RC0402.pdf; Author: CERN DEM JLC; CreateDate: 03.12.2007; LatestRevisionDate: 17.10.2012
R102 = R0402_5K1_1%_0.0625W_100PPM: Resistor - 1%; Part Description: General Purpose Thick Film Chip Resistor; Manufacturer: GENERIC; Manufacturer1 Part Number: 232270675102L; TC: ±100ppm/°C; PressFit: No; Part Number: R0402_5K1_1%_0.0625W_100PPM; Component Kind: Standard; Component Type: Standard; Pin Count: 2; Value: 5k1; Status: Not Recommended; Power: 0.0625W; Tolerance: ±1%; Manufacturer Part Number: R0402_5K1_1%_0.0625W_100PPM; Case: 0402; Mounted: Yes; Sense: No; Socket: No; SMD: Yes; Manufacturer1 Example: YAGEO PHYCOMP; Manufacturer1 ComponentHeight: 0.4mm; HelpURL: \\cern.ch\dfs\Applications\Altium\Datasheets\R0402_Phycomp_RC0402.pdf; Author: CERN DEM JLC; CreateDate: 03.12.2007; LatestRevisionDate: 17.10.2012
TP1-TP6 = SMD_PAD_1.27X1.27MM: Part Description: 1.27mm x 1.27mm PCB Copper Area (SMD Test Point); Mounted: No; Part Number: SMD_PAD_1.27X1.27MM; Component Kind: Standard (No BOM); Component Type: Standard (No BOM); Pin Count: 1; Family: Test Point; Socket: No; SMD: Yes; Sense: No; Status: None; ComponentHeight: 0mm; HelpURL: Undefined; Author: CERN DEM JLC; CreateDate: 12.01.2008; LatestRevisionDate: 12.01.2008; PackageDescription: 1.27mm x 1.27mm PCB Copper Area (SMD Test Point)